# EAGLE design EMGsensor v2.1 sch (EAGLE 7.2.0)
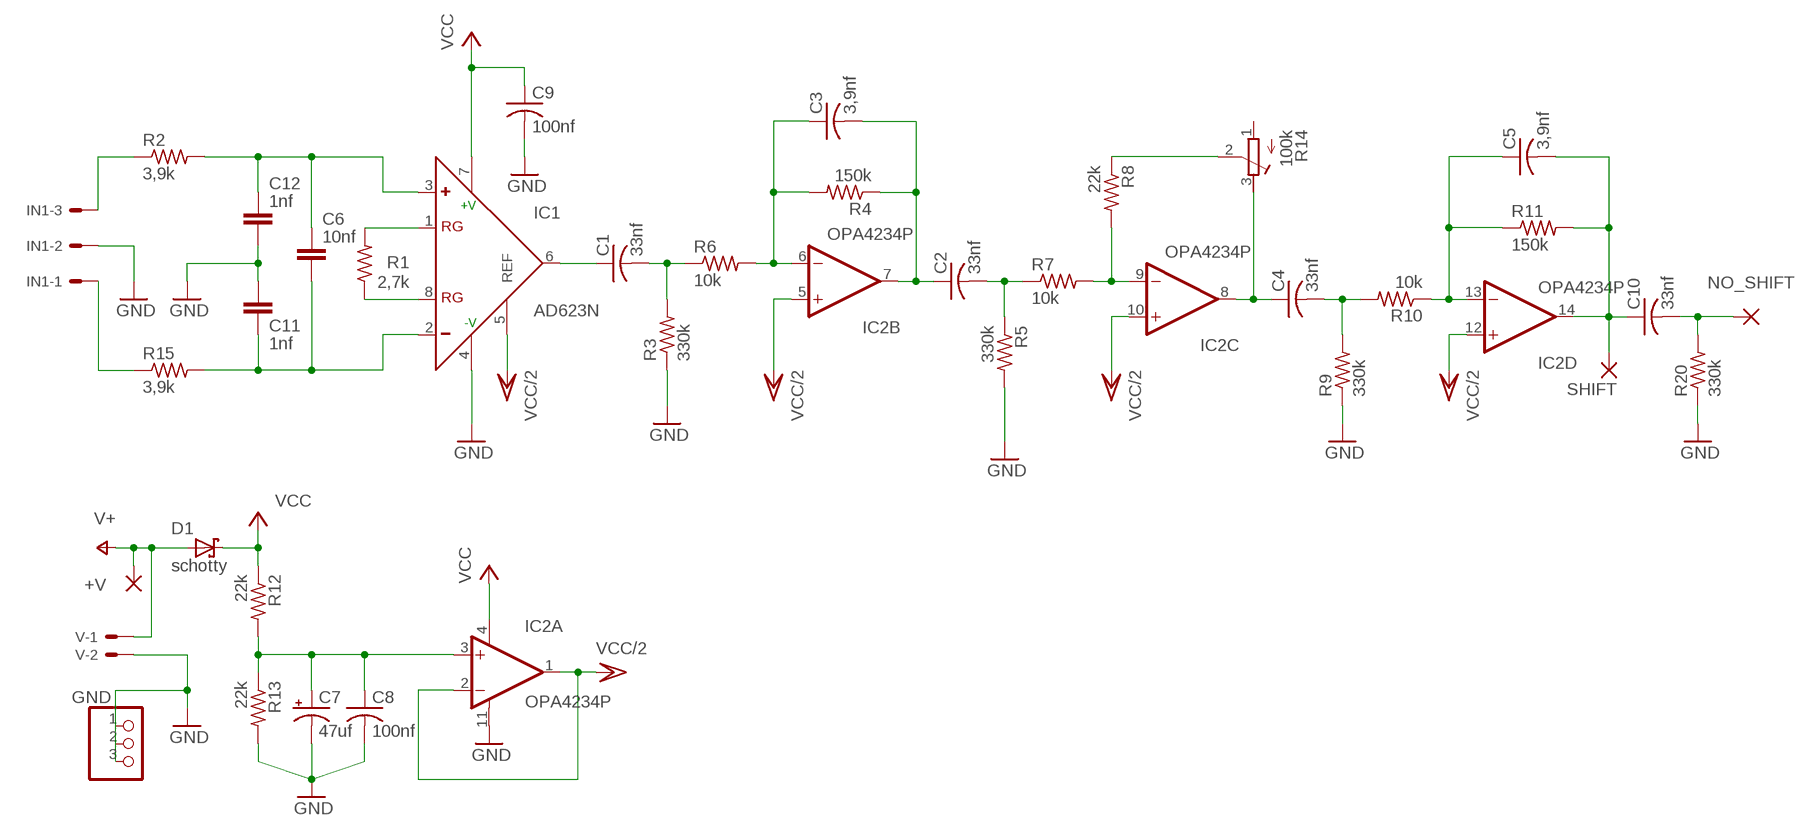
[diagram p0: schematic, sheet 1]

## Parts
+V  2,54/0,9  [2,54/0,9]
C1  33nf  C-US050-024X044  [C050-024X044]
C2  33nf  C-US050-024X044  [C050-024X044]
C3  3,9nf  C-US025-025X050  [C025-025X050]
C4  33nf  C-US025-025X050  [C025-025X050]
C5  3,9nf  C-US025-025X050  [C025-025X050]
C6  10nf  C-EU050-024X044  [C050-024X044]
C7  47uf  CPOL-USE2.5-5  [E2,5-5]
C8  100nf  C-US050-024X044  [C050-024X044]
C9  100nf  C-US050-024X044  [C050-024X044]
C10  33nf  C-US050-024X044  [C050-024X044]
C11  1nf  C-EU050-024X044  [C050-024X044]
C12  1nf  C-EU050-024X044  [C050-024X044]
D1  schotty  SCHOTTKY-DIODEDO35-7  [DO35-7]
GND  PINHD-1X3  [1X03]
IC1  AD623N  [DIL08]
IC2  OPA4234P  [DIL14]
IN1  22-27-2031-03  [6410-03]
NO_SHIFT  2,54/0,9  [2,54/0,9]
R1  2,7k  R-US_0207/7  [0207/7]
R2  3,9k  R-US_0207/7  [0207/7]
R3  330k  R-US_0207/7  [0207/7]
R4  150k  R-US_0207/5V  [0207/5V]
R5  330k  R-US_0207/7  [0207/7]
R6  10k  R-US_0207/7  [0207/7]
R7  10k  R-US_0207/7  [0207/7]
R8  22k  R-US_0207/7  [0207/7]
R9  330k  R-US_0207/7  [0207/7]
R10  10k  R-US_0207/7  [0207/7]
R11  150k  R-US_0207/2V  [0207/2V]
R12  22k  R-US_0207/7  [0207/7]
R13  22k  R-US_0207/7  [0207/7]
R14  100k  R-TRIMM3339P  [RTRIM3339P]
R15  3,9k  R-US_0207/7  [0207/7]
R20  330k  R-US_0207/7  [0207/7]
SHIFT  2,54/0,9  [2,54/0,9]
V  22-27-2021-02  [6410-02]

## Nets
N$1: C1.1 IC1.6(OUT)
N$2: C1.2 R3.2 R6.1
N$3: C3.1 IC2.6(B:-IN) R4.2 R6.2
N$4: C2.1 C3.2 IC2.7(B:OUT) R4.1
N$5: C2.2 R5.1 R7.1
N$6: IC2.9(C:-IN) R7.2 R8.2
N$7: C4.1 IC2.8(C:OUT) R14.3(E)
N$8: C4.2 R9.2 R10.2
N$9: C5.1 IC2.13(D:-IN) R10.1 R11.1
N$10: C5.2 C10.1 IC2.14(D:OUT) R11.2 SHIFT.1(P)
N$14: R8.1 R14.2(S)
N$16: IC1.1(RG) R1.2
N$18: C6.1 C12.1 IC1.3(+) R2.2
N$19: C6.2 C11.2 IC1.2(-) R15.2
N$20: IN1.3 R2.1
N$21: C10.2 NO_SHIFT.1(P) R20.2
N$23: IN1.1 R15.1
N$40: IC1.5(REF) IC2.1(A:OUT) IC2.2(A:-IN) ; supply symbol labelled VCC/2
N$47: C9.1 D1.C IC1.7(+V) IC2.4(A:V+) R12.1 ; supply symbol labelled VCC
N$51: C7.+ C8.1 IC2.3(A:+IN) R12.2 R13.1
N$90: +V.1(P) D1.A V.1 ; supply symbol labelled V+
N$136: IC1.8(RG) R1.1
N$197: C7.- C8.2 C9.2 C11.1 C12.2 GND.1 GND.2 GND.3 IC1.4(-V) IC2.11(A:V-) IN1.2 R3.1 R5.2 R9.1 R13.2 R20.1 V.2 ; supply symbol labelled GND
VCC/2: IC2.5(B:+IN) IC2.10(C:+IN) IC2.12(D:+IN)
Unconnected: R14.1(A)

## Library data of the parts
+V NO_SHIFT SHIFT = wirepad:2,54/0,9: THROUGH-HOLE PAD
C1-C5 C8-C10 = rcl:C-US: CAPACITOR, American symbol
C6 C11 C12 = rcl:C-EU: CAPACITOR, European symbol
C7 = rcl:CPOL-US: POLARIZED CAPACITOR, American symbol
D1 = diode:SCHOTTKY-DIODE: Schottky Diode
GND = pinhead:PINHD-1X3: PIN HEADER
IC1 = analog-devices:AD623: Single-Supply, Rail-to-Rail, Low Cost Instrumentation Amplifier Source: http://www.analog.com/static/imported-files/data_sheets/AD623.pdf; MF: ALTERA CORPORATION; MPN: AD623ANZ; OC_FARNELL: 9603700; OC_NEWARK: 59K4402
IC2 = burr-brown:OPA4234: Low Power, Precision Single-Supply Operational Amplifiers; OC_FARNELL: unknown; OC_NEWARK: unknown
IN1 = con-molex:22-?-03: CONNECTOR wire to board 2.54 mm (.1 inch) pitch header; OC_FARNELL: unknown; OC_NEWARK: unknown
R1-R13 R15 R20 = rcl:R-US_: RESISTOR, American symbol
R14 = rcl:R-TRIMM: Trimm resistor
V = con-molex:22-?-02: CONNECTOR wire to board 2.54 mm (.1 inch) pitch header; OC_FARNELL: unknown; OC_NEWARK: unknown

## Board
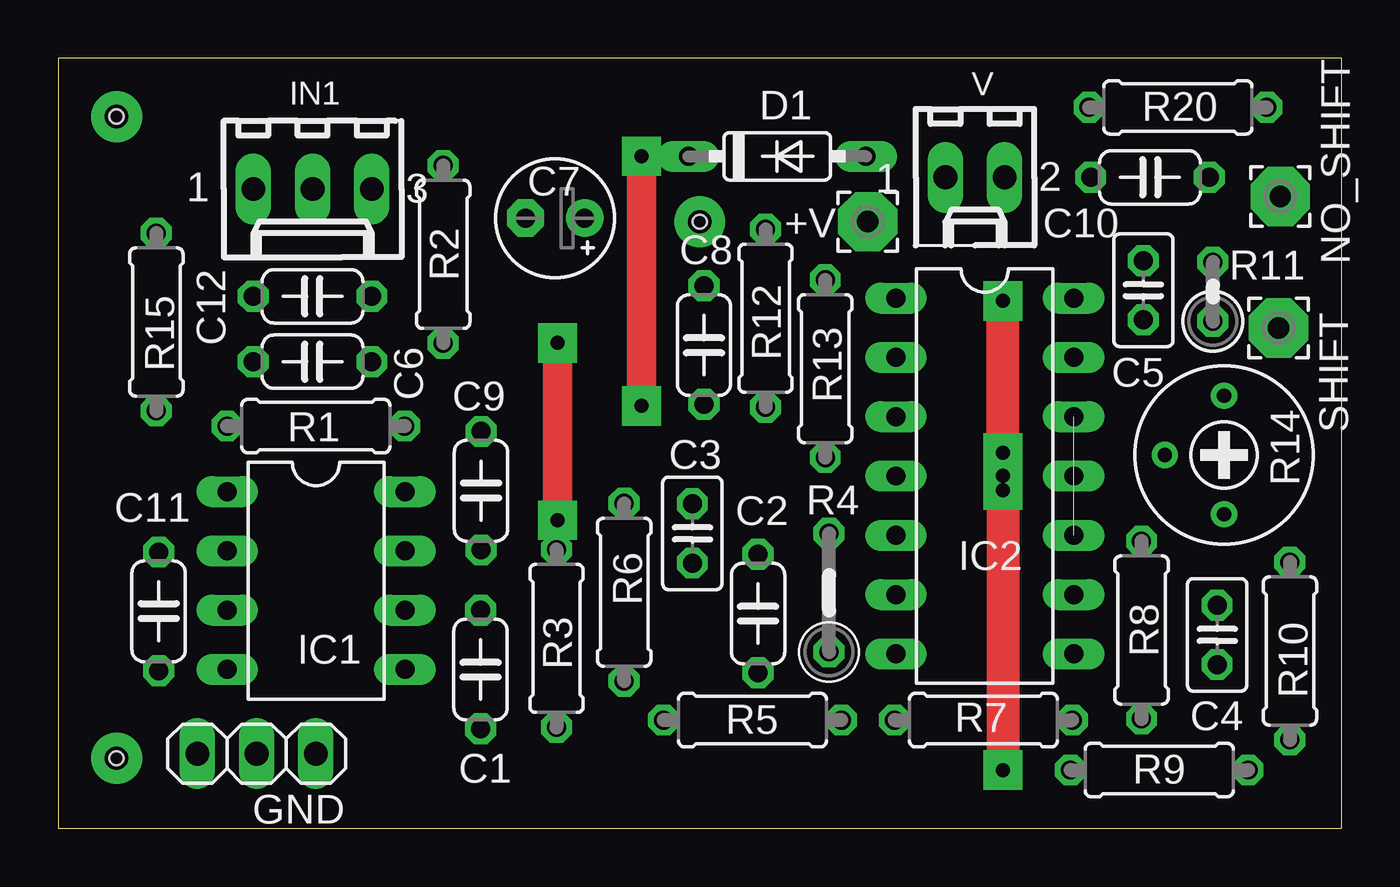
[diagram p1: board, top side]
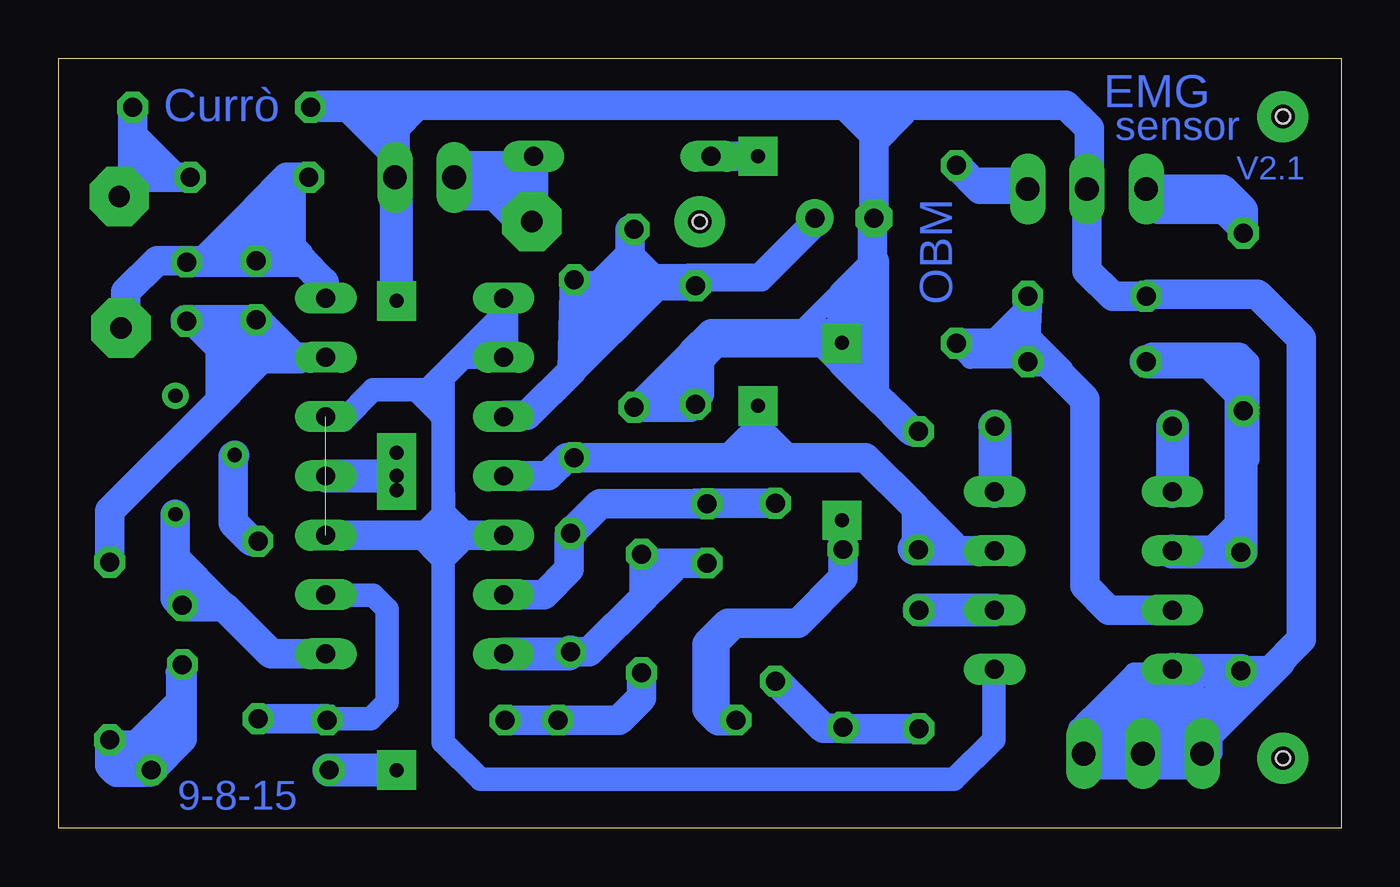
[diagram p2: board, bottom side, seen from below]

Size 55 x 33 mm. Coordinates in mm from the lower left corner, seen from the top.
Outline: 0,0 55,0 55,33 0,33 0,0
Copper layers (1*16): Top 0.035mm / dielectric 1.5mm / Bottom 0.035mm
Design rules "default": minimum track width 10mil, minimum drill 24mil, track to track 8mil, track to pad 8mil, pad to pad 8mil, via to via 8mil, smd to smd 8mil, copper to edge 40mil, drill to drill 8mil, minimum pad ring 10mil, minimum via ring 8mil, stop-mask expansion 4mil, vias tented up to drill 0mil, thermal gap 10mil
Holes 0.6 mm at 2.5,30.5 27.5,26 2.5,3

### Footprints (pad centres in the part's own frame; a part is rotated, then mirrored left to right if it is on the bottom)
2,54/0,9 = drill 0.914 pad 2.54 octagon: 1 0,0
C050-024X044 = drill 0.813 octagon: 1 -2.54,0; 2 2.54,0
C025-025X050 = drill 0.813 octagon: 1 -1.27,0; 2 1.27,0
E2,5-5 = drill 0.813 pad 1.6: + -1.27,0 | drill 0.813 pad 1.6 octagon: - 1.27,0
DO35-7 = drill 0.813 long: A 3.81,0; C -3.81,0
1X03 = drill 1.016 long: 1 -2.54,0; 2 0,0; 3 2.54,0
DIL08 = drill 0.813 long: 1 -3.81,-3.81; 2 -1.27,-3.81; 3 1.27,-3.81; 4 3.81,-3.81; 5 3.81,3.81; 6 1.27,3.81; 7 -1.27,3.81; 8 -3.81,3.81
DIL14 = drill 0.813 long: 1 -7.62,-3.81; 2 -5.08,-3.81; 3 -2.54,-3.81; 4 0,-3.81; 5 2.54,-3.81; 6 5.08,-3.81; 7 7.62,-3.81; 8 7.62,3.81; 9 5.08,3.81; 10 2.54,3.81; 11 0,3.81; 12 -2.54,3.81; 13 -5.08,3.81; 14 -7.62,3.81
6410-03 = drill 1.016 long: 1 2.54,0; 2 0,0; 3 -2.54,0
0207/7 = drill 0.813 octagon: 1 -3.81,0; 2 3.81,0
0207/5V = drill 0.813 octagon: 1 -2.54,0; 2 2.54,0
0207/2V = drill 0.813 octagon: 1 -1.27,0; 2 1.27,0
RTRIM3339P = drill 0.61: 1 -2.54,0; 2 0,-2.54; 3 2.54,0
6410-02 = drill 1.016 long: 1 1.27,0; 2 -1.27,0

### Placement (x,y rotation side)
+V  34.7,26 0 top
C1  18.1,6.81 270 top
C2  30,9.21 270 top
C3  27.18,12.64 270 top
C4  49.68,8.29 270 top
C5  46.52,23.06 90 top
C6  10.9,20 180 top
C7  21.3,26.15 180 top
C8  27.68,20.71 270 top
C9  18.12,14.47 90 top
C10  46.8,27.9 0 top
C11  4.3,9.3 90 top
C12  10.9,22.8 180 top
D1  30.82,28.8 0 top
GND  8.5,3.2 180 top
IC1  11.05,10.62 270 top
IC2  39.72,15.1 270 top
IN1  10.9,27.4 180 top
NO_SHIFT  52.39,27.08 0 top
R1  11.04,17.24 180 top
R2  16.5,24.6 270 top
R3  21.36,8.14 270 top
R4  33.04,10.1 90 top
R5  29.76,4.64 180 top
R6  24.26,10.12 90 top
R7  39.66,4.64 0 top
R8  46.44,8.5 270 top
R9  47.2,2.5 0 top
R10  52.8,7.6 270 top
R11  49.5,23 90 top
R12  32.88,19.7 90 top
R13  30.32,21.86 270 top
R14  49.98,16 270 top
R15  4.2,21.7 270 top
R20  48,30.9 0 top
SHIFT  52.32,21.44 90 top
V  39.3,27.9 180 top

### Tracks (layer width: path | path; a pad name or v marks a point on that pad's centre or on a via)
N$1
  Bottom 1.422: IC1.6 C1.1
N$2
  Bottom 1.27: C1.2 21.3,4.27 R3.2 21.39,4.3 22.2,4.3 24.21,6.31 R6.1
N$3
  Bottom 1.27: IC2.6 34.18,10.02 33.1,11.1 33.1,12.58 R4.2 31.77,13.91 27.7,13.91 | C3.1 27.7,13.91 | R6.2 27.68,13.93 27.7,13.91
N$4
  Bottom 1.27: R4.1 32.24,7.56 29.9,9.9 29.9,11.65 C2.1 29.62,11.37 C3.2
  Bottom 1.422: IC2.7 33.12,7.48 R4.1
N$5
  Bottom 1.27: R7.1 R5.1 30.96,4.64 30,5.6 C2.2
N$6
  Bottom 1.016: 43.52,4.69 41.61,4.69 40.9,5.4 40.9,9.4 41.5,10 43.51,10 IC2.9
  Bottom 1.27: R8.2 43.52,4.69 R7.2
N$7
  Bottom 1.27: R14.3 49.98,9.86 C4.1 49.62,9.5 47.9,9.5 45.88,7.48 IC2.8
N$8
  Bottom 1.27: R10.2 52.8,2.7 52.5,2.4 51.11,2.4 R9.2 49.68,3.83 C4.2
N$9
  Bottom 1.27: IC2.13 44.91,20.18 C5.1 | C5.1 47.8,21.79 | 47.8,21.79 49.56,21.79 | 47.8,21.79 47.7,21.69 47.7,18.7 52.8,13.6 R10.1 | R11.1 46.58,21.73 C5.1
N$10
  Bottom 1.27: C5.2 46.52,26.58 45.2,27.9 C10.1 | C5.2 50.77,24.33 52.1,23 52.1,21.66 SHIFT.1 | C5.2 44.53,24.33 44.47,24.27 | IC2.14 43.6,22.79 43.6,23.4 43.7,23.5 44.47,24.27 | R11.2 44.47,24.27
N$14
  Bottom 1.27: R8.1 46.71,12.31 47.5,13.1 47.5,15.94 R14.2
N$16
  Bottom 1.422: R1.2 IC1.1
N$18
  Bottom 1.27: C12.1 13.54,20.5 | 13.54,20.5 C6.1 12.6,20 11,18.4 11,10.4 9.95,9.35 IC1.3 | R2.2 13.73,20.79 13.54,20.5
N$19
  Bottom 1.422: IC1.2 7.24,11.84 C11.2 4.3,17.09 R15.2 4.5,20 C6.2
N$20
  Bottom 1.27: IN1.3 15.49,27.4 R2.1
N$21
  Bottom 1.27: R20.2 51.81,28 | 51.81,28 51.81,27.66 NO_SHIFT.1 | C10.2 51.71,27.9 51.81,28
N$23
  Bottom 1.27: R15.1 4.2,26.5 5.1,27.4 IN1.1
N$40
  Bottom 0.813: 38.5,14.2 38.5,13.7 37.4,12.6
  Bottom 1.016: IC2.2 37.62,20.18 38.5,19.3 38.5,14.2 38.5,12.9 | 38.5,12.9 38.5,12.5 | 38.5,12.5 38.5,12.4 | 38.34,12.56 38.4,12.5 | 38.4,12.5 38.5,12.4 | 38.84,12.56 38.5,12.9 | 38.14,12.56 38.4,12.3 38.4,12.5 | 38.4,12.5 38.5,12.5 | 38.5,12.4 38.5,3.7 36.9,2.1 16.6,2.1 14.9,3.8 14.9,6.77 IC1.5
  Bottom 1.27: IC2.1 IC2.2
N$47  (via drill 0.6 pad 1.68)
  Top 1.27: v25,28.8 v25,18.1
  Bottom 0.813: 18.3,13.8 18,13.8 16.5,12.3 | 25,17.8 25,17.4 | 25,17.4 23.8,16.2 | 25,17.4 26.1,16.3
  Bottom 1.27: IC1.7 18.08,11.89 C9.1 18.2,12.01 18.2,13.7 18.3,13.8 20.39,15.89 24.9,15.89 | IC2.4 34,15.1 33.21,15.89 R12.1 24.9,15.89 | D1.C v25,28.8 | v25,18.1 25,17.8 25,15.99 24.9,15.89
N$51
  Bottom 0.813: C7.+ 22.57,25.93 25,23.5 27.43,23.5 C8.1
  Bottom 1.27: R12.2 32.89,23.01 | 32.89,23.01 32.98,19.62 34.9,17.7 35.85,17.7 IC2.3 | R13.1 30.5,25.65 30.5,23.45 30.3,23.25 | C8.1 30.3,23.25 | 30.3,23.25 32.66,23.25 32.89,23.01
N$90
  Bottom 1.27: D1.A 34.63,28.2 | 34.63,28.2 34.63,26.07 +V.1 | V.1 34.93,27.9 34.63,28.2
N$136
  Bottom 1.422: R1.1 IC1.8
N$145
  Bottom 1.422: 18.3,12 18.2,12
N$146  (via drill 0.6 pad 1.68)
  other vias: 40.5,14.5
N$147  (via drill 0.6 pad 1.68)
  other vias: 40.5,16.1
N$148
  Bottom 0.813: 39.9,18.8 39.8,18.8 38.7,17.7 | 36,22.2 36,22.1 39.3,18.8
  Bottom 1.016: 43.5,17.5 42.8,17.5 41.5,18.8 39.9,18.8 39.3,18.8 38.6,18.8
N$149
  Bottom 0.813: 51.7,30.4 51.7,29.9 | 51.7,29.9 51.7,29.4 50.4,28.1 | 49.9,28.1 51.7,29.9
N$150
  Bottom 0.813: 46.4,26.4 46.2,26.4 44.5,24.7
N$151
  Bottom 0.813: 45.8,25.2 45.8,25.1 45.4,24.7
N$152
  Bottom 0.813: 45.6,27.3 45.6,26.6 | 45.6,26.6 45.6,25.8 46,25.4 | 45.6,26.6 44.5,27.7
N$153
  Bottom 0.813: 45.2,27.3 45.2,25.2
N$154
  Bottom 0.813: 46.3,25.7 47.6,24.4
N$155
  Bottom 0.813: 46.3,27 46.4,27 49,24.4
N$156
  Bottom 0.813: 47.9,24.8 47.8,24.8 47,25.6
N$157
  Bottom 0.813: 44.8,27.6 44.8,24.9
N$158
  Bottom 0.813: 49.5,21.6 49.4,21.6 47.9,20.1
N$159
  Bottom 0.813: 48.3,20.8 48.3,18.3
N$160
  Bottom 0.813: 47.8,21 46.6,21
N$161
  Bottom 0.813: 44.6,19.9 47.4,19.9 47.5,20
N$162
  Bottom 0.813: 45.8,20.6 47,20.6 47.3,20.3
N$163
  Bottom 0.813: 48.3,18.2 47.9,18.2 46.1,20
N$164
  Bottom 0.813: 50,12.4 50,11.9 | 50,11.9 50,10.9 48.5,9.4 | 47.8,9.3 47.8,9.7 50,11.9
N$165
  Bottom 0.813: 52.3,3.8 50.2,3.8 50.1,3.7
N$166
  Bottom 0.813: 52.5,3.2 51.2,3.2 51.1,3.3
N$167
  Bottom 0.813: 49.9,5.3 49.9,4.8 51.2,3.5 | 49.9,6.8 49.9,5.3 | 49.9,5.3 51.8,3.4
N$168
  Bottom 0.813: 50,6.7 50,5.5 51.9,3.6
N$169
  Bottom 0.813: 36.6,12.5 37.4,12.5 38.4,11.5
N$170
  Bottom 0.813: 38.4,14.4 38.4,13.7 39.5,12.6
N$171
  Bottom 0.813: 39.7,12.5 39.6,12.5 38.6,11.5
N$172
  Bottom 0.813: 35.8,22.1 37.9,20 38,20 39,19
N$173
  Bottom 0.813: 39.4,31.1 39.5,31.1 39.6,31.2 43.9,31.2
N$174
  Bottom 0.813: 35,27.1 37.9,27.1 38.1,27.3
N$175
  Bottom 0.813: 35.3,28.6 37.5,28.6 37.7,28.4
N$176
  Bottom 0.813: 37.8,26.9 36.4,26.9 35.2,25.7
N$177
  Bottom 0.813: 30.3,24.9 30.5,24.9 32,23.4
N$178
  Bottom 0.813: 31.6,23.1 32.7,22
N$179
  Bottom 0.813: 30.6,23 30.9,23 33,20.9
N$180
  Bottom 0.813: 30.4,22.9 30.7,22.9 33,20.6
N$181
  Bottom 0.813: 33,19.3 29.4,22.9
N$182
  Bottom 0.813: 30.1,22.7 30.5,22.7 32.6,20.6
N$187
  Bottom 0.813: 28,23.8 24.9,23.8 23,25.7
N$189
  Bottom 0.813: 27.9,19.5 28,19.5 29.3,18.2
N$190
  Bottom 0.813: 27.9,20.4 27.9,20.2 30,18.1
N$191
  Bottom 0.813: 28,20.3 28,20.5 30.2,18.3
N$192
  Bottom 0.813: 28.1,19.7 27.6,19.7 26.6,20.7
N$193
  Bottom 0.813: 27.3,20.7 27.3,18.5 27.8,18
N$194
  Bottom 0.813: 27.2,20.6 22.3,20.6 21.1,19.4
N$195
  Bottom 0.813: 26.2,21.1 23.4,21.1 21.7,22.8
N$196
  Bottom 0.813: 20.7,23.2 20.7,19.4 20.5,19.2
N$197  (via drill 0.6 pad 1.68)
  Top 1.27: v21.4,13.2 v21.4,20.8
  Top 1.422: v40.5,2.5 v40.5,15.1 v40.5,22.6
  Bottom 0.813: 20,24.2 19.8,24.4 19.8,18.4 19.2,17.8 | 40.6,28 40.6,29.3 42.2,30.9 | 40.4,28.4 42.9,30.9 | 20.2,23.7 20.2,18.8 20.1,18.7
  Bottom 1.27: R5.2 25.99,4.6 26.7,4.6 27.2,5.1 27.2,7.9 26.3,8.8 23.3,8.8 21.36,10.74 R3.1 21.36,13.16 v21.4,13.2 | R13.2 27.9,18.05 C8.2 27.78,20.42 27,21.2 21.8,21.2 v21.4,20.8 | v21.4,20.8 21.4,22.8 20.1,24.1 20.1,26.08 C7.- 20.03,30.93 20.1,31 | C9.2 18.41,17.01 19.2,17.8 20.1,18.7 21.4,20 v21.4,20.8 | V.2 40.57,30.03 39.7,30.9 | 20.1,31 39.6,31 39.7,30.9 | R20.1 42.9,30.9 42.2,30.9 39.7,30.9 | 20.1,31 11.8,31 10.8,30 10.8,27.3 | 10.8,26.9 10.8,27.3 | 10.8,27.3 IN1.2 10.9,23.9 9.8,22.8 C12.2 8.26,22.9 3.6,22.9 1.7,21 1.7,8.1 3.04,6.76 7.24,6.76 7.24,3.46 7.5,3.2
  Bottom 1.422: C11.1 7.24,6.76 IC1.4 | GND.1 GND.2 7.5,3.2 GND.3 | IC2.11 v40.5,15.1 | v40.5,2.5 R9.1 | v40.5,22.6 40.5,27.83 V.2
N$198
  Bottom 0.813: 20.1,28.4 20.1,29.5 21.3,30.7
N$199
  Bottom 0.813: 20,27.6 20,29.2 18.7,30.5
N$200
  Bottom 0.813: 14,27.9 15.8,27.9
N$201
  Bottom 0.813: 13.5,22.7 13.5,22.4 14.9,21
N$202
  Bottom 0.813: 13.7,20.1 15.9,20.1 16.6,20.8
N$203
  Bottom 0.813: 13.3,22.7 13.3,21.1 11.9,19.7
N$204
  Bottom 0.813: 4.7,26.7 5.5,26.7 | 5.5,26.7 7.9,26.7 8.1,26.9 | 5.5,26.7 4.4,25.6
N$205
  Bottom 0.813: 4.4,26.3 7.9,26.3 8.3,26.7
N$206
  Bottom 0.813: 3.9,15.8 3.9,20 4.3,20.4 8.2,20.4 8.3,20.3
N$207
  Bottom 0.813: 8.2,19.8 5.9,19.8 4.2,18.1
N$208
  Bottom 0.813: 4.6,19.2 4.6,13.1 5.7,12
N$209
  Bottom 0.813: 18.3,13.6 18.3,13.5 16.9,12.1
N$211
  Bottom 0.813: 6.8,6.9 7,6.9 7,7.1
N$213
  Bottom 0.813: 11.2,4 8.3,4 8.1,4.2 8.1,4.5 8,4.6 10.6,4.6 10.7,4.7
N$216
  Bottom 0.813: 7.8,6.5 8.2,6.5 8.7,6
N$217
  Bottom 0.813: 30.6,9.1 30.4,9.1 28.5,11
N$218
  Bottom 0.813: 26.6,5 26.6,7.9 25.9,8.6
N$219
  Bottom 0.813: 7.9,6.2 8.6,6.2 10,4.8 10.8,4.8 11,4.6
N$220
  Bottom 0.813: 8.5,4.4 8.5,5.3 8.2,5.6 8.2,5.2 9.1,5.2 9.3,5
N$221
  Bottom 0.813: 7.8,3.4 7,3.4 3.7,6.7
N$222
  Bottom 0.813: 5.3,6 6.7,4.6 6.7,5.3 6.2,5.8 6.4,5.8 6.5,5.9 6.6,5.9 6.7,5.8
N$223
  Bottom 0.813: 5.5,5.1 5.5,3.2 6.2,2.5 10.9,2.5 11.3,2.9 11.3,3.2 11.2,3.3
N$224
  Bottom 0.813: 8.1,4 5.4,4 2.4,7
N$225
  Bottom 0.813: 7.9,6.7 8.9,6.7 11.3,4.3
N$226  (via drill 1 pad 2.18)
  other vias: 2.5,30.5
N$227  (via drill 1 pad 2.18)
  other vias: 2.5,3
N$228
  Bottom 0.813: 30.45,25.53 30.45,24.8 29.44,23.79 25,23.79 22.84,25.95
N$229
  Bottom 0.813: 27.86,23.42 24.81,23.42 22.5,25.73
N$230  (via drill 1 pad 2.18)
  other vias: 27.5,26
VCC/2  (1 unrouted)
  Bottom 1.27: IC2.10 IC2.5

### Text on the board
Bottom: EMG | sensor | Currò | V2.1 | OBM | 9-8-15